# EAGLE design DCC cDecoder (EAGLE 9.6.2)
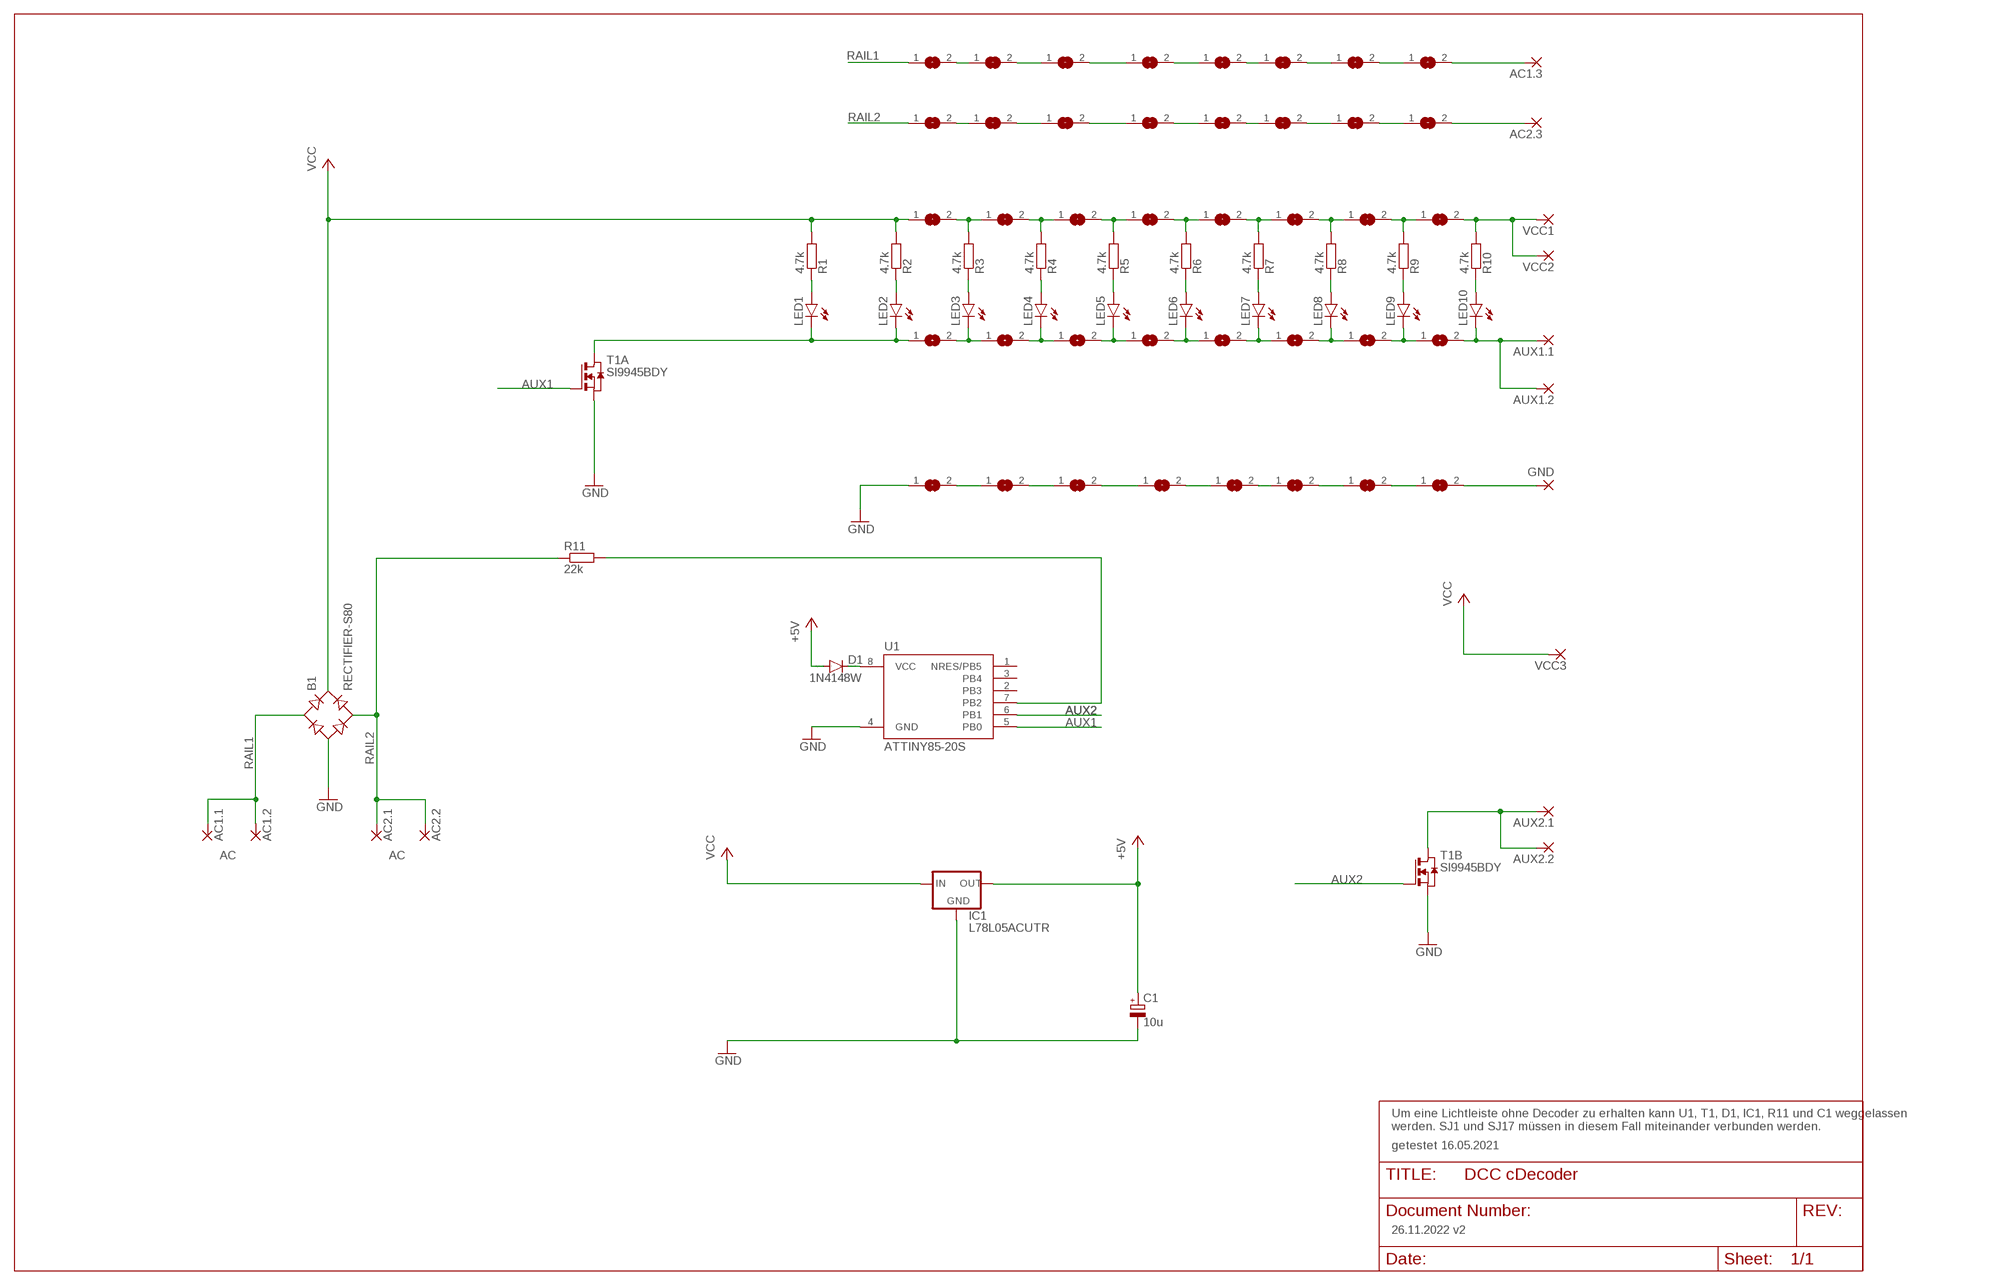
[diagram p0: schematic, sheet 1]

## Parts
AC1.1  AC1.1  SMD2  [SMD1,27-2,54]
AC1.2  AC1.2  SMD2  [SMD1,27-2,54]
AC1.3  AC1.3  SMD2  [SMD1,27-2,54]
AC2.1  AC2.1  SMD2  [SMD1,27-2,54]
AC2.2  AC2.2  SMD2  [SMD1,27-2,54]
AC2.3  AC2.3  SMD2  [SMD1,27-2,54]
AUX1.1  AUX1.1  SMD2  [SMD1,27-2,54]
AUX1.2  AUX1.2  SMD2  [SMD1,27-2,54]
AUX2.1  AUX2.1  SMD2  [SMD1,27-2,54]
AUX2.2  AUX2.2  SMD2  [SMD1,27-2,54]
B1  RECTIFIER-S80  [TO-269AA]
C1  10u  CPOL-EUA/3216-18W  [A/3216-18W]
D1  1N4148W  CGRM4001-G  [SOD-123_MINI-SMA]
GND  SMD2  [SMD1,27-2,54]
IC1  L78L05ACUTR  [SOT89R]
LED1  LEDCHIPLED_0805  [CHIPLED_0805]
LED2  LEDCHIPLED_0805  [CHIPLED_0805]
LED3  LEDCHIPLED_0805  [CHIPLED_0805]
LED4  LEDCHIPLED_0805  [CHIPLED_0805]
LED5  LEDCHIPLED_0805  [CHIPLED_0805]
LED6  LEDCHIPLED_0805  [CHIPLED_0805]
LED7  LEDCHIPLED_0805  [CHIPLED_0805]
LED8  LEDCHIPLED_0805  [CHIPLED_0805]
LED9  LEDCHIPLED_0805  [CHIPLED_0805]
LED10  LEDCHIPLED_0805  [CHIPLED_0805]
R1  4.7k  R-EU_R0805  [R0805]
R2  4.7k  R-EU_R0805  [R0805]
R3  4.7k  R-EU_R0805  [R0805]
R4  4.7k  R-EU_R0805  [R0805]
R5  4.7k  R-EU_R0805  [R0805]
R6  4.7k  R-EU_R0805  [R0805]
R7  4.7k  R-EU_R0805  [R0805]
R8  4.7k  R-EU_R0805  [R0805]
R9  4.7k  R-EU_R0805  [R0805]
R10  4.7k  R-EU_R0805  [R0805]
R11  22k  R-EU_R0805  [R0805]
SJ1  SJC  [SJC]
SJ2  SJC  [SJC]
SJ3  SJC  [SJC]
SJ4  SJC  [SJC]
SJ5  SJC  [SJC]
SJ6  SJC  [SJC]
SJ7  SJC  [SJC]
SJ8  SJC  [SJC]
SJ9  SJC  [SJC]
SJ10  SJC  [SJC]
SJ11  SJC  [SJC]
SJ12  SJC  [SJC]
SJ13  SJC  [SJC]
SJ14  SJC  [SJC]
SJ15  SJC  [SJC]
SJ16  SJC  [SJC]
SJ17  SJ  [SJ]
SJ18  SJ  [SJ]
SJ19  SJ  [SJ]
SJ20  SJ  [SJ]
SJ21  SJ  [SJ]
SJ22  SJ  [SJ]
SJ23  SJ  [SJ]
SJ24  SJ  [SJ]
SJ25  SJC  [SJC]
SJ26  SJC  [SJC]
SJ27  SJC  [SJC]
SJ28  SJC  [SJC]
SJ29  SJC  [SJC]
SJ30  SJC  [SJC]
SJ31  SJC  [SJC]
SJ32  SJC  [SJC]
SJ33  SJC  [SJC]
SJ34  SJC  [SJC]
SJ35  SJC  [SJC]
SJ36  SJC  [SJC]
SJ37  SJC  [SJC]
SJ38  SJC  [SJC]
SJ39  SJC  [SJC]
SJ40  SJC  [SJC]
T1  SI9945BDY  NMOS2SO8  [SO8]
U1  ATTINY85-20S  [SOIC8_EIAJ_208MIL]
VCC1  VCC1  SMD2  [SMD1,27-2,54]
VCC2  VCC2  SMD2  [SMD1,27-2,54]
VCC3  VCC3  SMD2  [SMD1,27-2,54]

## Nets
+5V: C1.+ D1.A IC1.2(OUT)
AUX1: T1.2(A:G) U1.5(PB0)
AUX2: T1.4(B:G) U1.6(PB1)
GND: B1.- C1.- IC1.3(GND) IC1.4(GND) SJ1.1 T1.1(A:S) T1.3(B:S) U1.4(GND)
N$1: LED2.A R2.1
N$2: LED1.A R1.1
N$3: R3.2 SJ2.2 SJ4.1
N$4: LED4.A R4.1
N$5: LED3.A R3.1
N$6: R6.2 SJ8.2 SJ10.1
N$7: R7.2 SJ10.2 SJ12.1
N$8: R8.2 SJ12.2 SJ14.1
N$9: R9.2 SJ14.2 SJ16.1
N$10: LED6.A R6.1
N$11: SJ1.2 SJ3.1
N$12: R4.2 SJ4.2 SJ6.1
N$13: LED7.A R7.1
N$14: LED8.A R8.1
N$15: AUX2.1.1(P) AUX2.2.1(P) T1.5(B:D) T1.6(B:D)
N$16: SJ3.2 SJ5.1
N$17: R5.2 SJ6.2 SJ8.1
N$18: SJ5.2 SJ7.1
N$19: LED3.C SJ17.2 SJ18.1
N$20: SJ7.2 SJ9.1
N$21: LED5.A R5.1
N$22: SJ9.2 SJ11.1
N$23: LED4.C SJ18.2 SJ19.1
N$24: SJ11.2 SJ13.1
N$25: LED9.A R9.1
N$26: SJ13.2 SJ15.1
N$27: LED10.A R10.1
N$28: GND.1(P) SJ15.2
N$29: LED6.C SJ20.2 SJ21.1
N$30: D1.C U1.8(VCC)
N$31: R10.2 SJ16.2 VCC1.1(P) VCC2.1(P)
N$32: LED5.C SJ19.2 SJ20.1
N$33: R11.2 U1.7(PB2)
N$34: AUX1.1.1(P) AUX1.2.1(P) LED10.C SJ24.2
N$35: LED7.C SJ21.2 SJ22.1
N$39: LED8.C SJ22.2 SJ23.1
N$40: LED9.C SJ23.2 SJ24.1
N$48: LED1.C LED2.C SJ17.1 T1.7(A:D) T1.8(A:D)
N$66: SJ25.2 SJ26.1
N$67: SJ26.2 SJ27.1
N$68: SJ27.2 SJ28.1
N$69: SJ28.2 SJ29.1
N$70: SJ29.2 SJ30.1
N$71: SJ30.2 SJ31.1
N$72: SJ31.2 SJ32.1
N$73: AC1.3.1(P) SJ32.2
N$74: SJ33.2 SJ34.1
N$75: SJ34.2 SJ35.1
N$76: SJ35.2 SJ36.1
N$77: SJ36.2 SJ37.1
N$78: SJ37.2 SJ38.1
N$79: SJ38.2 SJ39.1
N$80: SJ39.2 SJ40.1
N$81: AC2.3.1(P) SJ40.2
RAIL1: AC1.1.1(P) AC1.2.1(P) B1.AC1 SJ25.1
RAIL2: AC2.1.1(P) AC2.2.1(P) B1.AC2 R11.1 SJ33.1
VCC: B1.+ IC1.1(IN) R1.2 R2.2 SJ2.1 VCC3.1(P)
Unconnected: U1.1(NRES/PB5) U1.2(PB3) U1.3(PB4)

## Notes on the sheet
- AC | AC
- Um eine Lichtleiste ohne Decoder zu erhalten kann U1, T1, D1, IC1, R11 und C1 weggelassen 
  werden. SJ1 und SJ17 müssen in diesem Fall miteinander verbunden werden.
- getestet 16.05.2021
- 26.11.2022 v2

## Library data of the parts
AC1.1-AC1.3 AC2.1-AC2.3 AUX1.1 AUX1.2 AUX2.1 AUX2.2 GND VCC1-VCC3 = wirepad:SMD2: SMD PAD
B1 = rectifier:RECTIFIER-: Rectifier
C1 = rcl:CPOL-EU: POLARIZED CAPACITOR, European symbol
D1 = diode:CGRM400*-G: Molded plasitc,JEDEC SOD-123/Mini SMA Source: Comchip CGRM4001-G.pdf
IC1 = _smd:L78L05ACUTR
LED1-LED10 = led:LED: LED OSRAM: - CHIPLED LG R971, LG N971, LY N971, LG Q971, LY Q971, LO R971, LY R971 LH N974, LH R974 LS Q976, LO Q976, LY Q976 LO Q996 - Hyper CHIPLED LW Q18S LB Q993, LB Q99A, LB R99A - SideLED LS A670, LO A670, LY A670, LG A670, LP A670 LB A673, LV A673, LT A673, LW A673 LH A674 LY A675 LS A676, LA A676, LO A676, LY A676, LW A676 LS A679, LY A679, LG A679 - Hyper Micro SIDELED® LS Y876, LA Y876, LO Y876, LY Y876 LT Y87S - SmartLED LW L88C, LW L88S LB L89C, LB L89S, LG L890 LS L89K, LO L89K, LY L89K LS L896, LA L896, LO L896, LY L896 - TOPLED LS T670, LO T670, LY T670, LG T670, LP T670 LSG T670, LSP T670, LSY T670, LOP T670, LYG T670 LG T671, LOG T671, LSG T671 LB T673, LV T673, LT T673, LW T673 LH T674 LS T676, LA T676, LO T676, LY T676, LB T676, LH T676, LSB T676, LW T676 LB T67C, LV T67C, LT T67C, LS T67K, LO T67K, LY T67K, LW E67C LS E67B, LA E67B, LO E67B, LY E67B, LB E67C, LV E67C, LT E67C LW T67C LS T679, LY T679, LG T679 LS T770, LO T770, LY T770, LG T770, LP T770 LB T773, LV T773, LT T773, LW T773 LH T774 LS E675, LA E675, LY E675, LS T675 LS T776, LA T776, LO T776, LY T776, LB T776 LHGB T686 LT T68C, LB T68C - Hyper Mini TOPLED® LB M676 - Mini TOPLED Santana® LG M470 LS M47K, LO M47K, LY M47K Source: http://www.osram.convergy.de LUXEON: - LUMILED® LXK2-PW12-R00, LXK2-PW12-S00, LXK2-PW14-U00, LXK2-PW14-V00 LXK2-PM12-R00, LXK2-PM12-S00, LXK2-PM14-U00 LXK2-PE12-Q00, LXK2-PE12-R00, LXK2-PE12-S00, LXK2-PE14-T00, LXK2-PE14-U00 LXK2-PB12-K00, LXK2-PB12-L00, LXK2-PB12-M00, LXK2-PB14-N00, LXK2-PB14-P00, LXK2-PB14-Q00 LXK2-PR12-L00, LXK2-PR12-M00, LXK2-PR14-Q00, LXK2-PR14-R00 LXK2-PD12-Q00, LXK2-PD12-R00, LXK2-PD12-S00 LXK2-PH12-R00, LXK2-PH12-S00 LXK2-PL12-P00, LXK2-PL12-Q00, LXK2-PL12-R00 Source: www.luxeon.com KINGBRIGHT: KA-3528ASYC Source: www.kingbright.com
R1-R11 = rcl:R-EU_: RESISTOR, European symbol; SPICEPREFIX: R
SJ1-SJ16 SJ25-SJ40 = _smd:SJC: SMD solder JUMPER
SJ17-SJ24 = jumper:SJ: SMD solder JUMPER
T1 = zetex:NMOS2: Dual MOS FET; OC_FARNELL: unknown; OC_NEWARK: unknown
U1 = attiny25_45_85:ATTINY85*: ATMEL ATtiny 85 Packages: P = PDIP 08 30mil S = SOIC 08 EIAJ 208mil Technologies Note: for complete ordering code (temp. range, finish, tape&reel etc.) see www.atmel.com • Supply Voltage: V = (1.8…5.5)V | [blank] = (2.7…5.5)V • Speed: 10 = 10 MHz | 20 = 20 MHz Author: Dipl.-Ing. FH Rainer Bayer HHN Hochschule Heilbronn (Heilbronn University), rainer.bayer@hs-heilbronn.de Ingenieurbüro ing-rb, mail@ing-rb.de

## Board
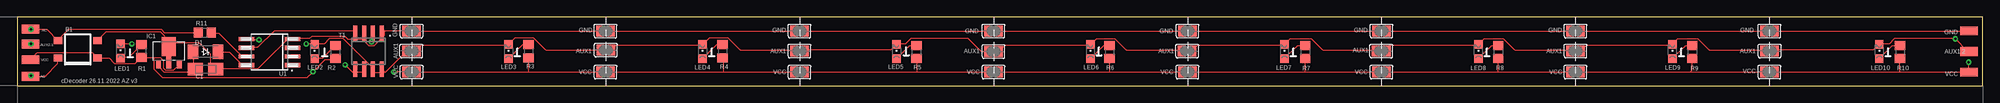
[diagram p1: board, top side]
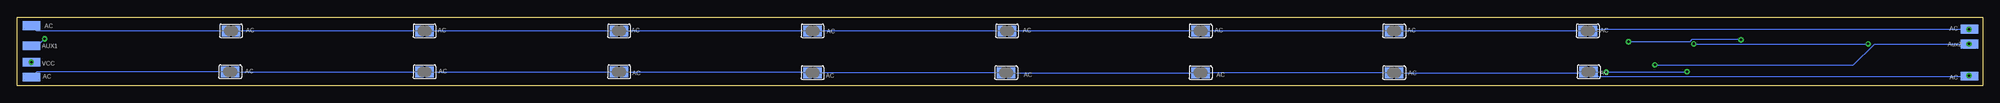
[diagram p2: board, bottom side, seen from below]

Size 285 x 10 mm. Coordinates in mm from the lower left corner, seen from the top.
Outline: 0,0 285,0 285,10 0,10 0,0
Copper layers (1*16): Top 0.035mm / dielectric 1.5mm / Bottom 0.035mm
Design rules "default": minimum track width 6mil, minimum drill 0.35mm, track to track 6mil, track to pad 6mil, pad to pad 6mil, via to via 6mil, smd to smd 6mil, copper to edge 40mil, drill to drill 6mil, minimum pad ring 10mil, minimum via ring 8mil, stop-mask expansion 4mil, vias tented up to drill 0mil, thermal gap 10mil

### Footprints (pad centres in the part's own frame; a part is rotated, then mirrored left to right if it is on the bottom)
SMD1,27-2,54 = smd 1.27 x 2.54: 1 0,0
TO-269AA = smd 1 x 1.25: + -1.28,-2.855; - 1.28,-2.855; AC1 -1.28,2.855; AC2 1.28,2.855
A/3216-18W = smd 2.15 x 1.8: + 1.475,0; - -1.475,0
SOD-123_MINI-SMA = smd 1.5 x 2.1: A 1.8,0; C -1.8,0
SOT89R = smd 0.7 x 1.1: 1 1.5,-1.75; 2 -1.5,-1.75 | smd 0.7 x 1.8: 3 0,-1.4 | smd 2 x 2.8: 4 0,0.9
CHIPLED_0805 = smd 1.2 x 1.2: A 0,-1.05; C 0,1.05
R0805 = smd 1.3 x 1.5: 1 -0.95,0; 2 0.95,0
SJC = smd 1.168 x 1.6: 1 -0.762,0; 2 0.762,0
SJ = smd 1.168 x 1.6: 1 -0.762,0; 2 0.762,0
SO8 = smd 0.6 x 2.2: 1 -1.905,-2.6; 2 -0.635,-2.6; 3 0.635,-2.6; 4 1.905,-2.6; 5 1.905,2.6; 6 0.635,2.6; 7 -0.635,2.6; 8 -1.905,2.6
SOIC8_EIAJ_208MIL = smd 0.6 x 2.286: 1 -1.905,-3.33; 2 -0.635,-3.33; 3 0.635,-3.33; 4 1.905,-3.33; 5 1.905,3.33; 6 0.635,3.33; 7 -0.635,3.33; 8 -1.905,3.33

### Placement (x,y rotation side)
AC1.1  1.91,1.4 270 bottom
AC1.2  1.91,1.36 270 top
AC1.3  282.96,1.27 270 bottom
AC2.1  1.91,8.25 90 top
AC2.2  1.91,8.26 270 bottom
AC2.3  282.96,8.76 270 bottom
AUX1.1  282.96,5.84 270 bottom
AUX1.2  283,5 90 top
AUX2.1  1.91,6.1 270 top
AUX2.2  1.91,6.1 270 bottom
B1  8.76,5.33 90 top
C1  27.3,2.41 180 top
D1  27.3,4.95 180 top
GND  283,8 90 top
IC1  21.97,4.83 0 top
LED1  14.99,5.08 0 top
LED2  43.12,5 0 top
LED3  71.25,5 0 top
LED4  99.38,5 0 top
LED5  127.5,5 0 top
LED6  155.62,5 0 top
LED7  183.75,5 0 top
LED8  211.88,5 0 top
LED9  240,5 0 top
LED10  270,5 0 top
R1  18.03,5.08 270 top
R2  46.12,4.91 270 top
R3  74.12,5.03 270 top
R4  102.25,5.03 270 top
R5  130.37,4.91 270 top
R6  158.37,4.91 270 top
R7  186.75,4.91 270 top
R8  214.75,4.91 270 top
R9  242.87,4.91 270 top
R10  273,4.91 270 top
R11  27.18,7.75 0 top
SJ1  57.19,8 0 top
SJ2  57.19,2 0 top
SJ3  85.31,8 0 top
SJ4  85.31,2 0 top
SJ5  113.44,8 0 top
SJ6  113.44,2 0 top
SJ7  141.56,8 0 top
SJ8  141.56,2 0 top
SJ9  169.69,8 0 top
SJ10  169.69,2 0 top
SJ11  197.81,8 0 top
SJ12  197.81,2 0 top
SJ13  225.94,8 0 top
SJ14  225.94,2 0 top
SJ15  254.06,8 0 top
SJ16  254.06,2 0 top
SJ17  57.15,5.08 0 top
SJ18  85.34,5.21 0 top
SJ19  113.41,5.08 0 top
SJ20  141.56,5 0 top
SJ21  169.65,5.08 0 top
SJ22  197.78,5.08 0 top
SJ23  225.96,5.08 0 top
SJ24  254.1,5.08 0 top
SJ25  57.15,2.03 180 bottom
SJ26  85.34,1.91 180 bottom
SJ27  113.41,1.91 180 bottom
SJ28  141.6,1.91 180 bottom
SJ29  169.67,1.91 180 bottom
SJ30  197.74,2.03 180 bottom
SJ31  225.93,2.03 180 bottom
SJ32  254.13,2.03 180 bottom
SJ33  57.28,8 180 bottom
SJ34  85.34,8 180 bottom
SJ35  113.41,8 180 bottom
SJ36  141.48,8 180 bottom
SJ37  169.67,8 180 bottom
SJ38  197.74,8 180 bottom
SJ39  225.93,8 180 bottom
SJ40  254,8 180 bottom
T1  50.93,5.03 180 top
U1  36.58,4.91 90 top
VCC1  283,2 90 top
VCC2  282.96,3.43 90 bottom
VCC3  1.91,3.81 90 top

### Tracks (layer width: path | path; a pad name or v marks a point on that pad's centre or on a via)
+5V
  Top 0.152: IC1.2 20.57,3.05 20.57,2.74 21.34,1.98 25.45,1.98 25.76,2.29 C1.+ 25.76,2.44 25.6,2.59 25.6,4.88 D1.A
AUX1  (via drill 0.35)
  Top 0.152: v51.36,6.4 51.66,6.71 51.66,8.08 T1.2 | v35.05,6.71 33.38,6.71 U1.5
  Bottom 0.152: v51.36,6.4 42.52,6.4 42.22,6.71 v35.05,6.71
AUX2
  Top 0.152: T1.4 48.62,8.08 37.34,8.08 34.9,5.64 33.38,5.64 U1.6
GND
  Top 0.152: B1.- 12.88,7.87 20.7,7.87 21.97,6.6 IC1.4 | IC1.3 21.95,3.5 21.95,5.64 IC1.4 | IC1.4 21.95,6.25 26.36,6.25 28.04,4.57 28.04,3.05 28.65,2.44 C1.- 28.8,2.44 34.9,2.44 39.17,6.71 39.78,6.71 U1.4 39.93,6.86 42.37,6.86 42.67,7.16 47.55,7.16 48.01,6.71 50.29,6.71 | 50.29,6.71 50.29,6.55 51.05,5.79 51.66,5.79 53.19,7.32 53.19,8.08 T1.1 53.34,8 SJ1.1 | 50.29,6.71 50.29,8.08 T1.3
N$1
  Top 0.152: LED2.A 43.13,3.96 44.2,3.96 46.02,5.79 R2.1
N$2
  Top 0.152: LED1.A 15.09,4.12 16.15,4.12 17.98,5.94 R1.1
N$3
  Top 0.152: SJ2.2 74.17,2 | 74.17,2 SJ4.1 | R3.2 74.12,2.04 74.17,2
N$4
  Top 0.152: LED4.A 101.41,5.98 R4.1
N$5
  Top 0.152: LED3.A 73.28,5.98 R3.1
N$6
  Top 0.152: SJ8.2 158.37,2 | 158.37,2 SJ10.1 | R6.2 158.37,2
N$7
  Top 0.152: SJ10.2 186.69,2 | 186.69,2 SJ12.1 | 186.69,2 186.75,2.06 R7.2
N$8
  Top 0.152: SJ12.2 214.63,2 | 214.63,2 SJ14.1 | 214.63,2 214.75,2.12 R8.2
N$9
  Top 0.152: SJ14.2 242.57,2 | 242.57,2 SJ16.1 | 242.57,2 242.87,2.3 R9.2
N$10
  Top 0.152: LED6.A 157.53,5.86 R6.1
N$11
  Top 0.152: SJ1.2 SJ3.1
N$12
  Top 0.152: SJ4.2 102.36,2 | 102.36,2 SJ6.1 | R4.2 102.36,3.97 102.36,2
N$13
  Top 0.152: LED7.A 185.66,5.86 R7.1
N$14
  Top 0.152: LED8.A 213.78,5.86 R8.1
N$15  (via drill 0.35)
  Top 0.152: v2.01,6.1 AUX2.2.1 | T1.6 50.14,1.98 48.77,1.98 T1.5 48.62,1.98 v47.55,3.05
  Bottom 0.152: AUX2.2.1 v2.01,6.1 15.7,6.1 18.75,3.05 v47.55,3.05
N$16
  Top 0.152: SJ3.2 SJ5.1
N$17
  Top 0.152: SJ6.2 130.43,2 | 130.43,2 SJ8.1 | R5.2 130.43,3.9 130.43,2
N$18
  Top 0.152: SJ5.2 SJ7.1
N$19
  Top 0.152: SJ17.2 57.91,5.18 58.67,5.94 71.17,5.94 LED3.C 71.32,6.1 72.24,7.01 74.83,7.01 76.66,5.18 84.57,5.18 SJ18.1
N$20
  Top 0.152: SJ7.2 SJ9.1
N$21
  Top 0.152: LED5.A 129.41,5.86 R5.1
N$22
  Top 0.152: SJ9.2 SJ11.1
N$23
  Top 0.152: SJ18.2 86.84,5.94 99.36,5.94 LED4.C 99.52,6.1 100.43,7.01 103.02,7.01 104.85,5.18 112.55,5.18 SJ19.1
N$24
  Top 0.152: SJ11.2 SJ13.1
N$25
  Top 0.152: LED9.A 241.91,5.86 R9.1
N$26
  Top 0.152: SJ13.2 SJ15.1
N$27
  Top 0.152: LED10.A 271.9,5.86 R10.1
N$28
  Top 0.152: SJ15.2 GND.1
N$29
  Top 0.152: SJ20.2 142.38,5.07 143.26,5.94 155.6,5.94 LED6.C 155.75,6.1 156.51,6.86 159.11,6.86 160.78,5.18 168.81,5.18 SJ21.1
N$30
  Top 0.152: D1.C 29.11,4.88 30.79,4.88 32.61,3.05 33.22,3.05 U1.8
N$31  (via drill 0.35)
  Top 0.152: SJ16.2 273.05,2 | 273.05,2 VCC1.1 282.96,2.04 VCC2.1 | 273.05,2 273,2.05 R10.2
  other vias: 282.96,3.43
N$32
  Top 0.152: 139.78,5 139.75,5.03 | 139.75,5.03 137.92,6.86 129.54,6.86 128.78,6.1 127.56,6.1 LED5.C 127.41,5.94 126.64,5.18 114.22,5.18 SJ19.2 | 139.75,5.03 140.79,5.03 SJ20.1
N$33
  Top 0.152: R11.2 28.19,7.62 29.26,7.62 32.46,4.42 33.22,4.42 U1.7
N$34  (via drill 0.35)
  Top 0.152: AUX1.2.1 282.85,5.03 v281.03,6.86 272.19,6.86 271.42,6.1 270.05,6.1 LED10.C 269.9,5.94 269.14,5.18 254.91,5.18 SJ24.2
  Bottom 0.152: v281.03,6.86 281.94,5.94 282.85,5.94 AUX1.1.1
N$35
  Top 0.152: SJ21.2 170.78,5.58 171.15,5.94 183.64,5.94 LED7.C 183.79,6.1 184.56,6.86 187.6,6.86 189.28,5.18 196.9,5.18 SJ22.1
N$36
  Top 0.152: 55.88,5.08 58.42,5.08
N$37
  Top 0.152: 84.3,5.2 86.3,5.2
N$38
  Top 0.152: 113.03,5.08 114.3,5.08
N$39
  Top 0.152: SJ22.2 198.67,5.58 199.03,5.94 211.84,5.94 LED8.C 211.99,6.1 212.75,6.86 215.49,6.86 217.17,5.18 225.15,5.18 SJ23.1
N$40
  Top 0.152: SJ23.2 227.59,5.94 239.88,5.94 LED9.C 240.03,6.1 240.79,6.86 243.69,6.86 245.36,5.18 253.24,5.18 SJ24.1
N$41
  Top 0.152: 140.97,5.08 142.24,5.08
N$42
  Top 0.152: 168.91,5.08 170.18,5.08
N$43
  Top 0.152: 196.85,5.08 198.62,5.08 198.7,5
N$44
  Top 0.152: 225.3,5.1 226.8,5.1 226.9,5
N$45
  Top 0.152: 252.73,5.08 255.18,5.08 255.2,5.1
N$48  (via drill 0.35)
  Top 0.152: SJ17.1 56.39,5.03 53.34,1.98 T1.8 53.19,1.98 51.82,1.98 T1.7 51.66,1.98 51.66,2.44 47.24,6.86 45.26,6.86 44.5,6.1 43.13,6.1 LED2.C 42.98,6.1 v41.91,6.1 | v16.61,6.1 15.09,6.1 LED1.C
  Bottom 0.152: v41.91,6.1 v16.61,6.1
N$66
  Bottom 0.152: SJ26.1 58.04,1.91 SJ25.2
N$67
  Bottom 0.152: SJ26.2 SJ27.1
N$68
  Bottom 0.152: SJ28.1 SJ27.2
N$69
  Bottom 0.152: SJ28.2 SJ29.1
N$70
  Bottom 0.152: SJ30.1 170.56,2.03 SJ29.2
N$71
  Bottom 0.152: SJ31.1 SJ30.2
N$72
  Bottom 0.152: SJ32.1 SJ31.2
N$73
  Bottom 0.152: SJ32.2 282.19,2.03 AC1.3.1
N$74
  Bottom 0.152: SJ33.2 SJ34.1
N$75
  Bottom 0.152: SJ34.2 SJ35.1
N$76
  Bottom 0.152: SJ35.2 SJ36.1
N$77
  Bottom 0.152: SJ36.2 SJ37.1
N$78
  Bottom 0.152: SJ37.2 SJ38.1
N$79
  Bottom 0.152: SJ38.2 SJ39.1
N$80
  Bottom 0.152: SJ39.2 SJ40.1
N$81
  Bottom 0.152: SJ40.2 282.19,8 AC2.3.1
RAIL1  (via drill 0.35)
  Top 0.152: B1.AC1 5.91,3.24 4.03,1.36 AC1.2.1 1.98,1.37 v1.98,1.49
  Bottom 0.152: 56.01,1.65 SJ25.1 55.75,1.4 AC1.1.1 | AC1.1.1 2.16,1.65 | v1.98,1.49 1.95,1.48 AC1.1.1
RAIL2  (via drill 0.35)
  Top 0.152: AC2.1.1 2.01,8.25 | 2.01,8.25 4.27,8.25 B1.AC2 5.94,6.71 7.47,8.23 20.88,8.23 21.34,7.77 26.21,7.77 R11.1 | 2.01,8.25 v2.01,8.22
  Bottom 0.152: SJ33.1 56.26,8.26 1.27,8.26 1.38,8.37 1.37,8.38 1.83,8.38 AC2.2.1 1.98,8.23 v2,8.23 v2.01,8.22
VCC  (via drill 0.35)
  Top 0.152: VCC3.1 2.92,4.83 10.85,4.83 B1.+ 11.73,3.96 13.41,3.96 14.17,3.2 17.07,3.2 17.98,4.12 R1.2 18.14,4.12 19.81,4.12 | 19.81,4.12 20.73,4.12 21.18,3.66 21.18,2.59 21.49,2.29 22.71,2.29 23.47,3.05 IC1.1 | 19.81,4.12 19.81,2.44 21.03,1.22 42.06,1.22 v42.9,2.06 44.65,3.81 46.02,3.81 R2.2 | SJ2.1 54.64,2 v54.61,2.03
  Bottom 0.152: v54.61,2.03 42.93,2.03 v42.9,2.06

### Text on the board
tPlace: . | . | cDecoder 26.11.2022 AZ v3
tNames: AC | GND | GND | GND | GND | GND | GND | GND | GND | GND | AUX1 | AUX1 | AUX1 | AUX1 | AUX1 | AUX1 | AUX1 | VCC | AUX1 | VCC | VCC | VCC | VCC | VCC | VCC | VCC | AC | VCC | VCC
bNames: AC | AC | AC | AC | AC | AC | AC | AC | AC | AC | Aux2 | AUX1 | VCC | AC | AC | AC | AC | AC | AC | AC | AC | AC | AC
tDocu: Um MOSFET zerstörung zu verhindern: / Lötkolbenspitze gegen Erde / verbinden, damit keine Spannung auf den / Mosfet kommt. / Nicht zu heiss Löten max 300°C